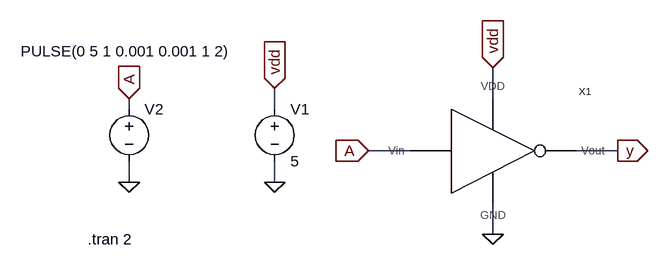
[diagram p0: schematic Not_Test.asc]
Not_Test.asc, the LTspice schematic file:
Version 4
SHEET 1 880 680
WIRE 240 16 240 -32
WIRE -320 32 -320 16
WIRE -96 32 -96 0
WIRE 112 96 48 96
WIRE 432 96 368 96
WIRE -320 144 -320 112
WIRE -96 144 -96 112
WIRE 240 224 240 176
FLAG -96 144 0
FLAG -320 144 0
FLAG 240 224 0
FLAG -96 0 vdd
IOPIN -96 0 In
FLAG -320 16 A
IOPIN -320 16 In
FLAG 240 -32 vdd
IOPIN 240 -32 In
FLAG 48 96 A
IOPIN 48 96 In
FLAG 432 96 y
IOPIN 432 96 Out
SYMBOL Not 240 96 R0
SYMATTR InstName X1
SYMBOL voltage -96 16 R0
WINDOW 123 0 0 Left 0
WINDOW 39 0 0 Left 0
SYMATTR InstName V1
SYMATTR Value 5
SYMBOL voltage -320 16 R0
WINDOW 123 0 0 Left 0
WINDOW 39 0 0 Left 0
WINDOW 3 -167 -73 Left 2
SYMATTR InstName V2
SYMATTR Value PULSE(0 5 1 0.001 0.001 1 2)
TEXT -384 232 Left 2 !.tran 2

The netlist it stands for:
* Not_Test.asc
XX1 vdd A y 0 Not  ; pins VDD Vin Vout GND
V1 vdd 0 5
V2 A 0 PULSE(0 5 1 0.001 0.001 1 2)
.tran 2
.backanno
.end